# Altium schematic sheet RELAYS.schdoc
size Tabloid
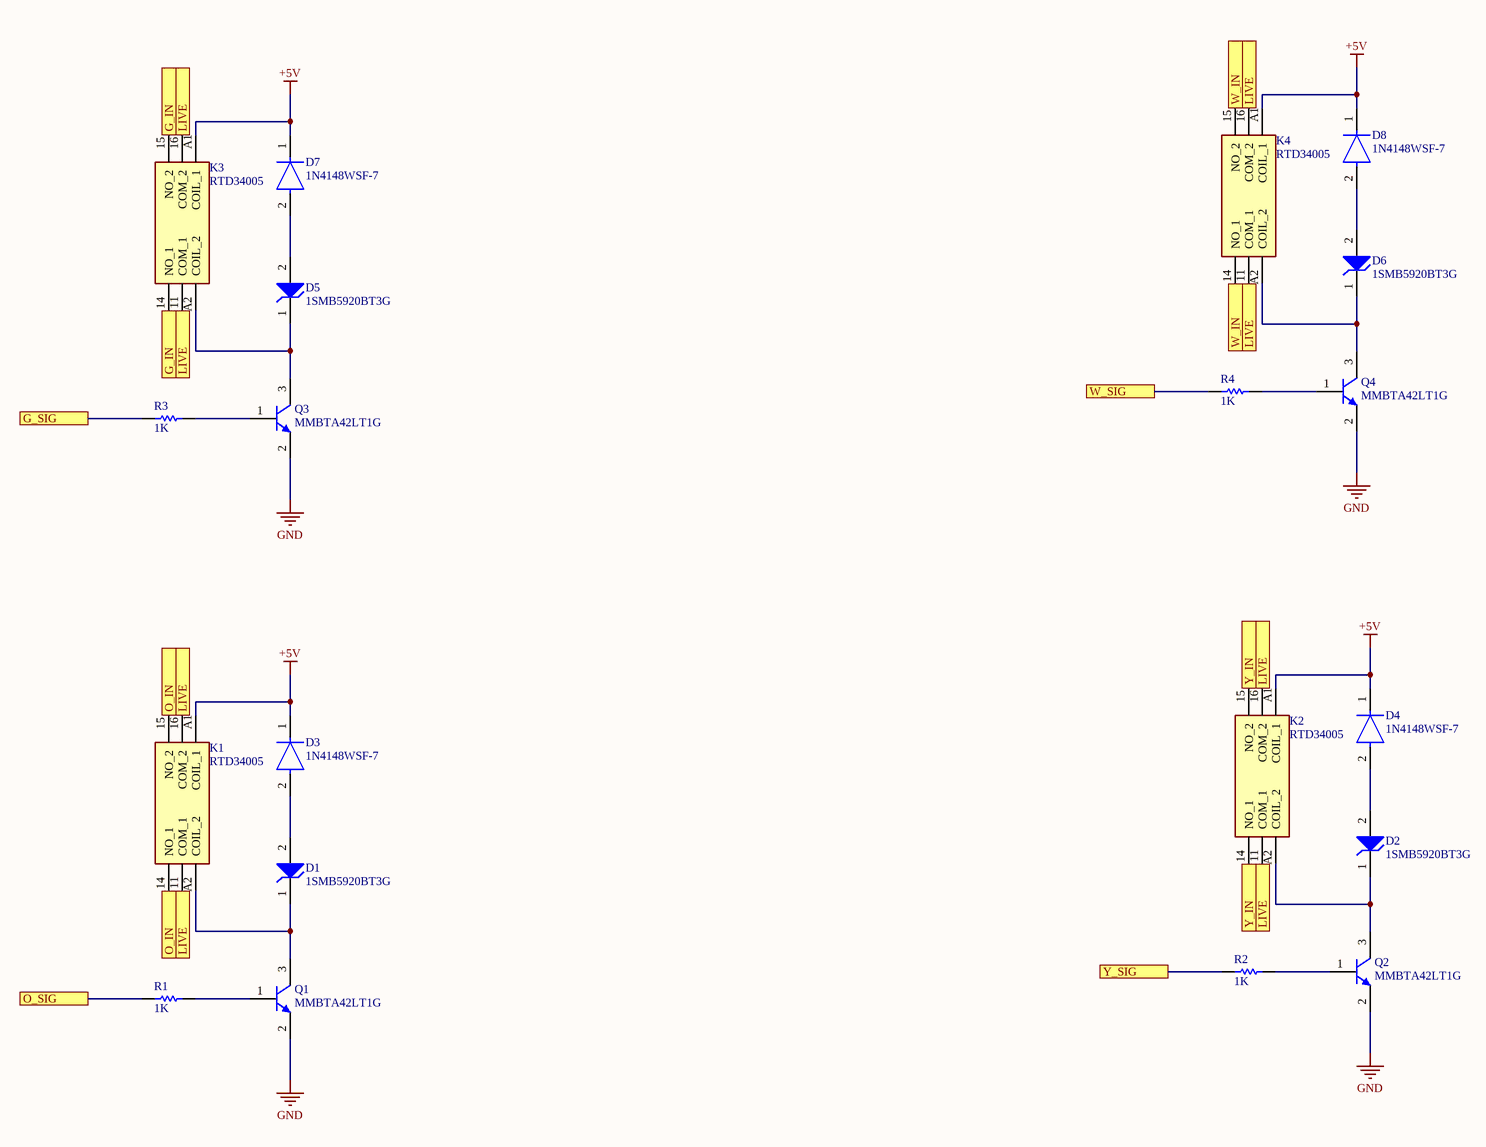
[diagram p0: RELAYS.schdoc]

## Parts
D1  1SMB5920BT3G  [ONSC-SMB-2-403A-03_H_V]
D2  1SMB5920BT3G  [ONSC-SMB-2-403A-03_H_V]
D3  1N4148WSF-7  [FP-SOD323F-MFG]
D4  1N4148WSF-7  [FP-SOD323F-MFG]
D5  1SMB5920BT3G  [ONSC-SMB-2-403A-03_H_V]
D6  1SMB5920BT3G  [ONSC-SMB-2-403A-03_H_V]
D7  1N4148WSF-7  [FP-SOD323F-MFG]
D8  1N4148WSF-7  [FP-SOD323F-MFG]
K1  RTD34005  [RTD34005]
K2  RTD34005  [RTD34005]
K3  RTD34005  [RTD34005]
K4  RTD34005  [RTD34005]
Q1  MMBTA42LT1G  [ONSC-SOT-23-3-318-08_V]
Q2  MMBTA42LT1G  [ONSC-SOT-23-3-318-08_V]
Q3  MMBTA42LT1G  [ONSC-SOT-23-3-318-08_V]
Q4  MMBTA42LT1G  [ONSC-SOT-23-3-318-08_V]
R1  1K  [RESC1608X55X30LL20T20]
R2  1K  [RESC1608X55X30LL20T20]
R3  1K  [RESC1608X55X30LL20T20]
R4  1K  [RESC1608X55X30LL20T20]

## Ports
G_IN, G_SIG, LIVE, O_IN, O_SIG, W_IN, W_SIG, Y_IN, Y_SIG

## Nets
+5V: D3.1(C) D4.1(C) D7.1(C) D8.1(C) K1.A1(COIL_1) K2.A1(COIL_1) K3.A1(COIL_1) K4.A1(COIL_1)
GND: Q1.2(E) Q2.2(E) Q3.2(E) Q4.2(E)
G_IN: K3.14(NO_1) K3.15(NO_2) ; port G_IN
G_SIG: R3.1 ; port G_SIG
LIVE: K1.11(COM_1) K1.16(COM_2) K2.11(COM_1) K2.16(COM_2) K3.11(COM_1) K3.16(COM_2) K4.11(COM_1) K4.16(COM_2) ; port LIVE
O_IN: K1.14(NO_1) K1.15(NO_2) ; port O_IN
O_SIG: R1.1 ; port O_SIG
W_IN: K4.14(NO_1) K4.15(NO_2) ; port W_IN
W_SIG: R4.1 ; port W_SIG
Y_IN: K2.14(NO_1) K2.15(NO_2) ; port Y_IN
Y_SIG: R2.1 ; port Y_SIG
NetD1_1: D1.1(K) K1.A2(COIL_2) Q1.3(C)
NetD1_2: D1.2(A) D3.2(A)
NetD2_1: D2.1(K) K2.A2(COIL_2) Q2.3(C)
NetD2_2: D2.2(A) D4.2(A)
NetD5_1: D5.1(K) K3.A2(COIL_2) Q3.3(C)
NetD5_2: D5.2(A) D7.2(A)
NetD6_1: D6.1(K) K4.A2(COIL_2) Q4.3(C)
NetD6_2: D6.2(A) D8.2(A)
NetQ1_1: Q1.1(B) R1.2
NetQ2_1: Q2.1(B) R2.2
NetQ3_1: Q3.1(B) R3.2
NetQ4_1: Q4.1(B) R4.2

## Notes on the sheet
- Title
- Size:
- Date:
- Tabloid
- Number:
- Time:
- Revision:
- Sheet
- of
- File:

## Library data of the parts
D1 D2 D5 D6 = CMP-1060-00222-1: 3 W Zener Voltage Regulator, 2-Pin SMB, Pb-Free, Tape and Reel; Manufacturer: On Semiconductor; VZ Typ (V): 6.2; Packing: Tape and Reel; PackageDescription: 2-Pin Small Molded Package, J-Bend Lead, Body 4.33 x 3.625 mm; Mounting Technology: Surface Mount; PackageVersion: Rev. H, 05/2011; ComponentLink1Description: Manufacturer URL; RoHS: Pb-Free; DatasheetVersion: Rev. 8; ComponentLink2Description: Datasheet; PartNumber: 1SMB5920BT3G; ComponentLink2URL: http://www.onsemi.com/pub_link/Collateral/1SMB5913BT3-D.PDF; ComponentLink1URL: http://www.onsemi.com/; ComponentLink3Description: Package Specification; PackageReference: SMB-2-403A-03_H; ComponentLink3URL: http://www.onsemi.com/pub_link/Collateral/1SMB5913BT3-D.PDF
D3 D4 D7 D8 = CMP-12791-000029-1: DIODE GEN PURP 100V 250MA SOD323; Manufacturer: Diodes Inc.; Value: 1.5pF; Max Surge Forward Current: 0.5A; Peak Reverse Current: 0.5uA; Max Junction Temp: +150°C; Description: Diode Standard 100V 250mA Surface Mount SOD-323F; Height: 0.75mm; Digikey Description: DIODE GEN PURP 100V 250MA SOD323; Automotive: No; Footprint Url: https://www.diodes.com/assets/Package-Files/SOD323F.pdf; Category: Diode; Manufacturer Part Number: 1N4148WSF-7; Max Repetitive Reverse Voltage: 100V; Lead Free: Yes; Temperature Range High: +150°C; Forward Current: 250mA; Reverse Voltage: 100V; Device Class L3: Rectifier Diodes; ComponentLink2URL: https://www.diodes.com/assets/Datasheets/1N4148WSF.pdf; Package: SOD323F; RoHS: TRUE; Mouser Description: Diodes - General Purpose, Power, Switching 200mW 2pF 75Vrrm 150mA 2A 1VF; Temperature: -55°C to +150°C; Capacitance: 1.5pF; Device Class L2: Diodes; ComponentLink2Description: Datasheet; Device Class L1: Discrete Semiconductors; Octopart: https://octopart.com/1n4148wsf-7-diodes+inc.-33798544; Temperature Range Low: -55°C
K1-K4 = RTD34005: Relay or Contactor; Manufacturer_Name: TE Connectivity; Datasheet Link: https://www.te.com/commerce/DocumentDelivery/DDEController?Action=showdoc&DocId=Data+Sheet%7FRT1%7F0219%7Fpdf%7FEnglish%7FENG_DS_RT1_0219.pdf%7F9-1393239-8; Height: 15.7mm; Manufacturer_Part_Number: RTD34005; Mouser Part Number: 655-RTD34005; Mouser Price/Stock: https://www.mouser.co.uk/ProductDetail/TE-Connectivity-Schrack/RTD34005?qs=BIWSwG%252BH%252B8jXtcbsbuQ74A%3D%3D; Arrow Part Number: RTD34005; Arrow Price/Stock: https://www.arrow.com/en/products/rtd34005/te-connectivity
Q1-Q4 = CMP-1048-00662-1: High Voltage Transistor, NPN Silicon, 3-Pin SOT-23, Pb-Free, Tape and Reel; Manufacturer: On Semiconductor; fT Min (MHz): 50; IC Continuous (A): 0.5; ComponentLink1URL: http://www.onsemi.com/; ComponentLink3URL: http://www.onsemi.cn/pub_link/Collateral/318-08.PDF; RoHS: TRUE; ComponentLink2Description: Datasheet; PartNumber: MMBTA42LT1G; Polarity: NPN; DatasheetVersion: Rev. 12; PackageReference: SOT-23-3-318-08; PackageDescription: 3-Pin Small Outline Transistor, Body 2.92 x 1.3 mm, Pitch 0.95 mm; ComponentLink3Description: Package Specification; ComponentLink1Description: Manufacturer URL; Packing: Tape and Reel; PackageVersion: Rev. AP, 11/2009; Mounting Technology: Surface Mount; ComponentLink2URL: http://www.onsemi.cn/pub_link/Collateral/MMBTA42LT1-D.PDF
R1-R4 = CMP-2000-00873-1: Manufacturer: Panasonic; Part Number: ERA3AEB102V